# EAGLE schematic CI Server Wiring (EAGLE 9.4.2)
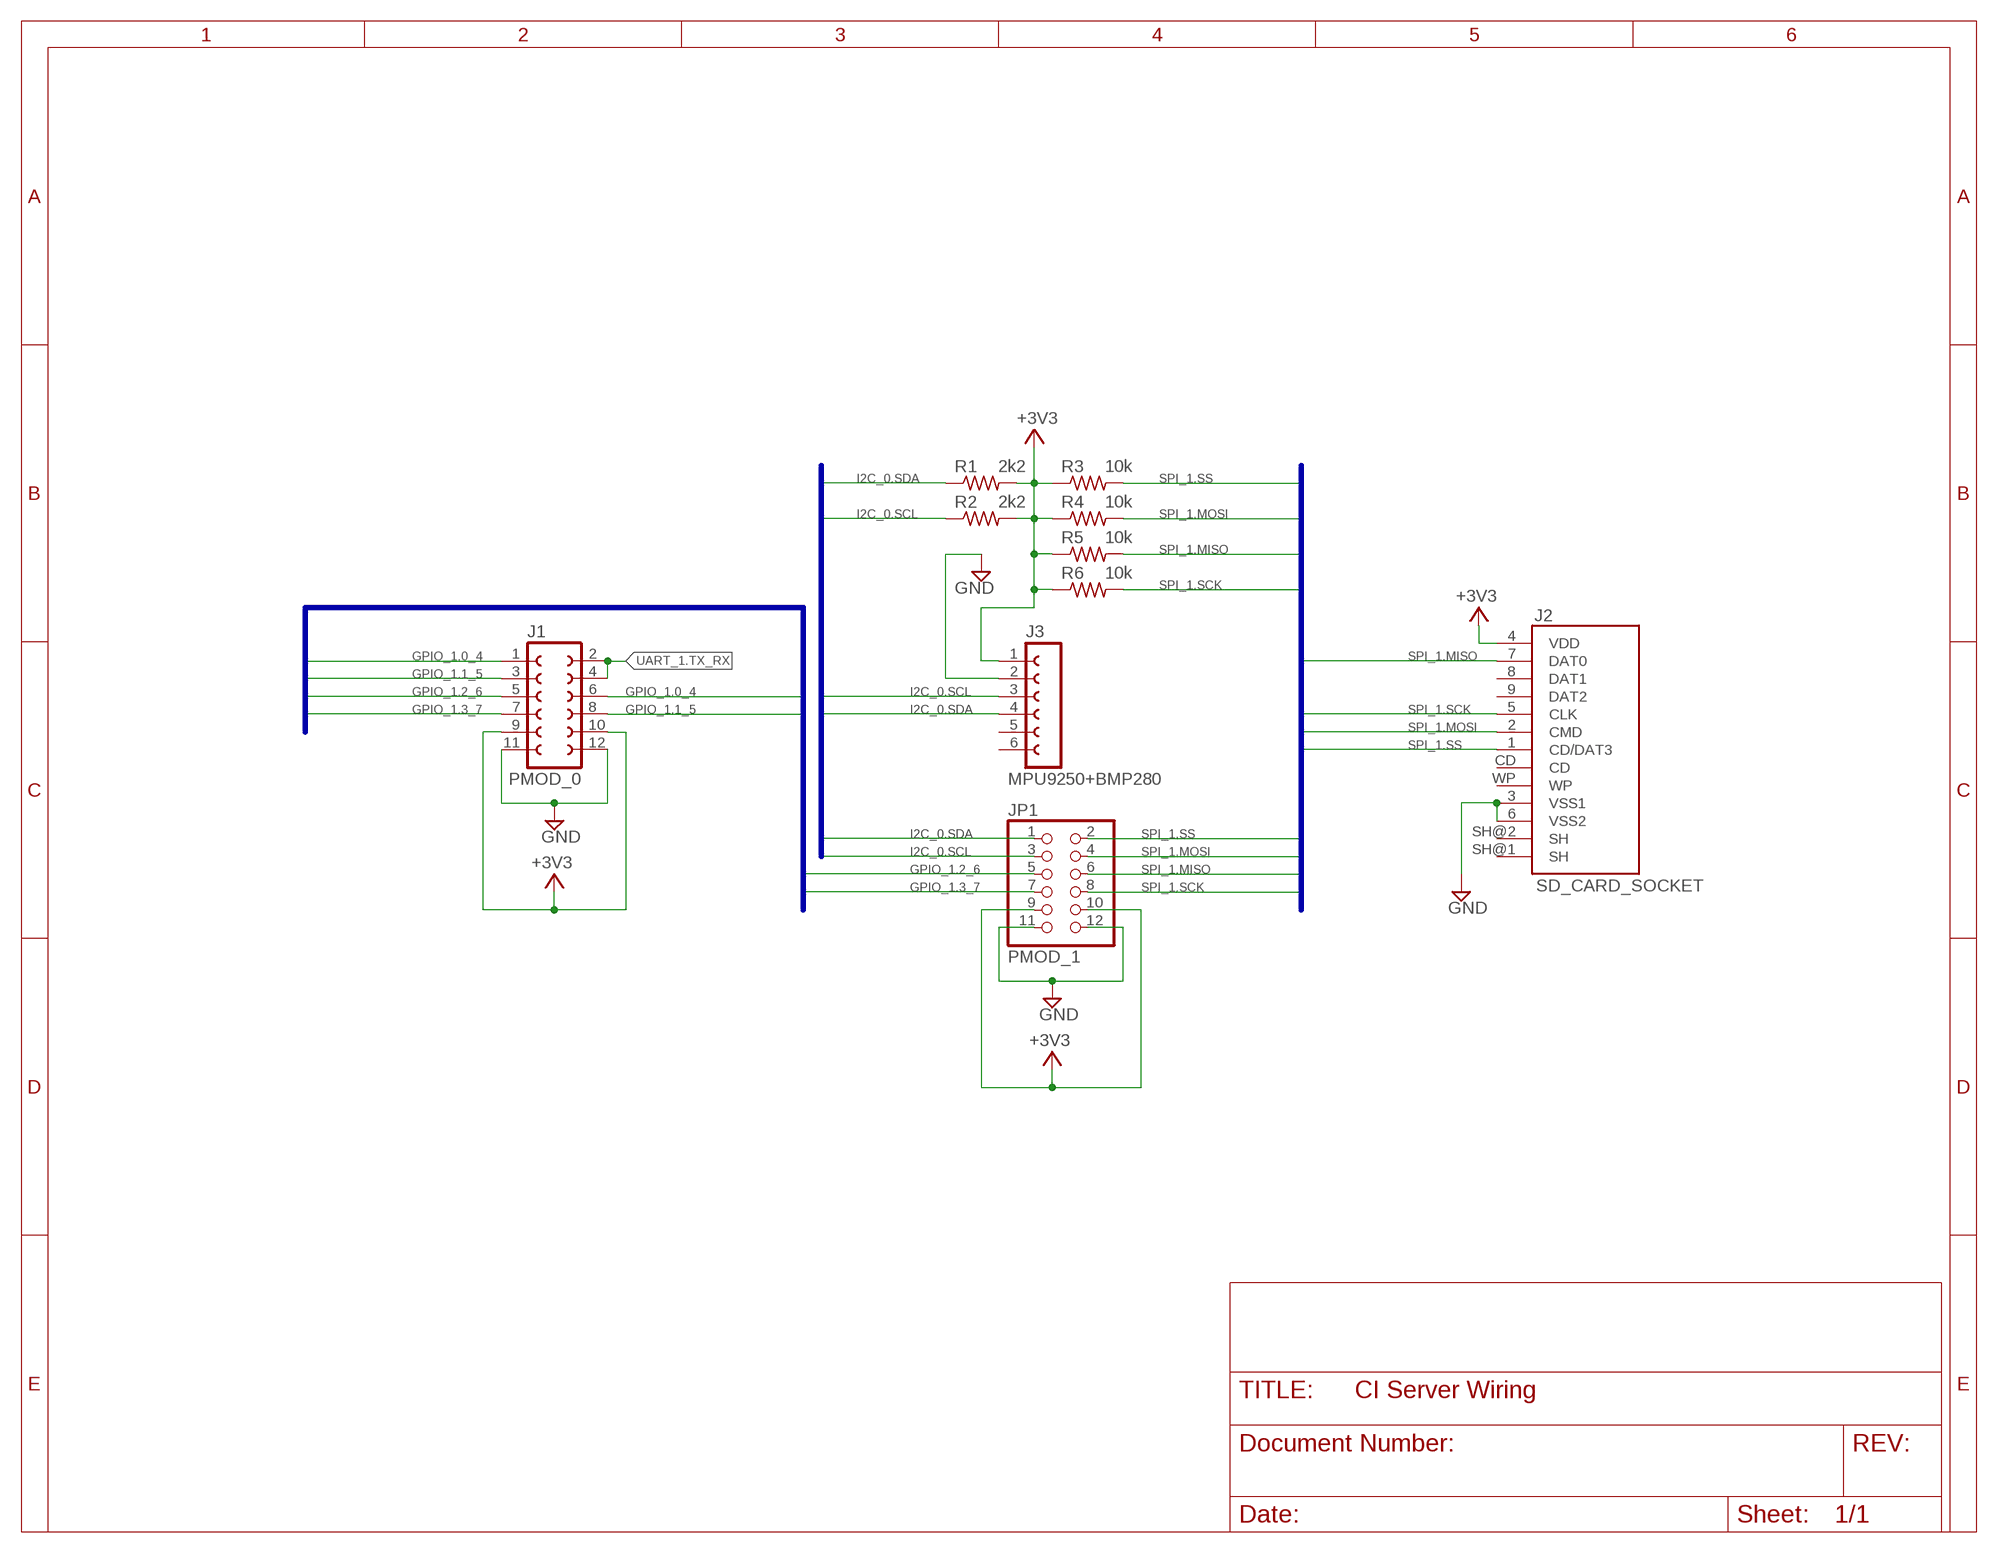
[diagram p0: schematic, sheet 1]

## Parts
J1  PMOD_0  FE06-2W  [FE06-2W]
J2  SD_CARD_SOCKET  [SD]
J3  MPU9250+BMP280  FE06-1  [FE06]
JP1  PMOD_1  PINHD-2X6/90  [2X06/90]
R1  2k2  R-US_0309/12  [0309/12]
R2  2k2  R-US_0309/12  [0309/12]
R3  10k  R-US_0309/12  [0309/12]
R4  10k  R-US_0309/12  [0309/12]
R5  10k  R-US_0309/12  [0309/12]
R6  10k  R-US_0309/12  [0309/12]

## Nets
+3V3: J1.9 J1.10 J2.4(VDD) J3.1 JP1.9 JP1.10 R1.2 R2.2 R3.1 R4.1 R5.1 R6.1
GND: J1.11 J1.12 J2.3(VSS1) J2.6(VSS2) J3.2 JP1.11 JP1.12
GPIO_1.0_4: J1.1 J1.6
GPIO_1.1_5: J1.3 J1.8
GPIO_1.2_6: J1.5 JP1.5
GPIO_1.3_7: J1.7 JP1.7
I2C_0.SCL: J3.3 JP1.3 R2.1
I2C_0.SDA: J3.4 JP1.1 R1.1
SPI_1.MISO: J2.7(DAT0) JP1.6 R5.2
SPI_1.MOSI: J2.2(CMD) JP1.4 R4.2
SPI_1.SCK: J2.5(CLK) JP1.8 R6.2
SPI_1.SS: J2.1(CD/DAT3) JP1.2 R3.2
UART_1.TX_RX: J1.2 J1.4
Unconnected: J2.8(DAT1) J2.9(DAT2) J2.CD J2.SH@1(SH) J2.SH@2(SH) J2.WP J3.5 J3.6

## Buses
GPIO_1.0_4,GPIO_1.1_5,GPIO_1.2_6,GPIO_1.3_7
I2C_0.SCL,I2C_0.SDA
SPI_1.MISO,SPI_1.MOSI,SPI_1.SCK,SPI_1.SS

## Library data of the parts
J1 = con-lsta:FE06-2W: FEMALE HEADER; OC_FARNELL: unknown; OC_NEWARK: unknown
J2 = SparkFun-Connectors:SD_CARD_SOCKET: SD Memory Card Connector (standard "large" size) Push-push normal type, CD enable, WP enable. Here is the connector we sell at SparkFun: SD/MMC Socket <https://www.sparkfun.com/products/12769> (PRT-12769) Datasheet <https://cdn.sparkfun.com/datasheets/Prototyping/19608.pdf> It is used on these SparkFun products: SparkFun SD/MMC Card Breakout <https://www.sparkfun.com/products/12941> (BOB-12941) SD Sniffer <https://www.sparkfun.com/products/11468> (TOL-11468); PROD_ID: CONN-11976; SF_ID: PRT-12769
J3 = con-lsta:FE06-1: FEMALE HEADER; OC_FARNELL: unknown; OC_NEWARK: unknown
JP1 = pinhead:PINHD-2X6: PIN HEADER
R1-R6 = rcl:R-US_: RESISTOR, American symbol; SPICEPREFIX: R